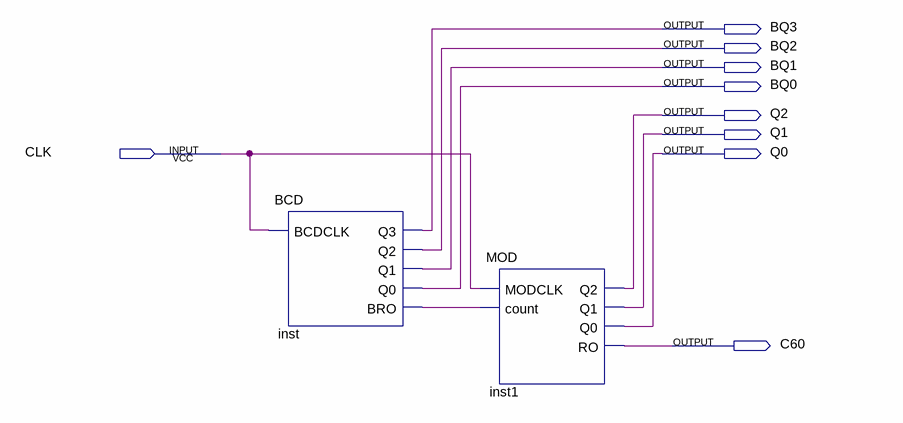
[diagram p0: schematic sheet]
// Quartus schematic Lab2.bdf as structural Verilog: 2 symbols, 9 pins
module Lab2 (
  input  CLK,
  output BQ3,
  output BQ2,
  output BQ1,
  output BQ0,
  output Q2,
  output Q1,
  output Q0,
  output C60
);

  wire inst_bro;

  BCD inst (.BCDCLK(CLK), .Q3(BQ3), .Q2(BQ2), .Q1(BQ1), .Q0(BQ0), .BRO(inst_bro));
  MOD inst1 (.MODCLK(CLK), .count(inst_bro), .Q2(Q2), .Q1(Q1), .Q0(Q0), .RO(C60));
endmodule
